# Altium schematic sheet AKS1_Sheet1.SchDoc
size A4
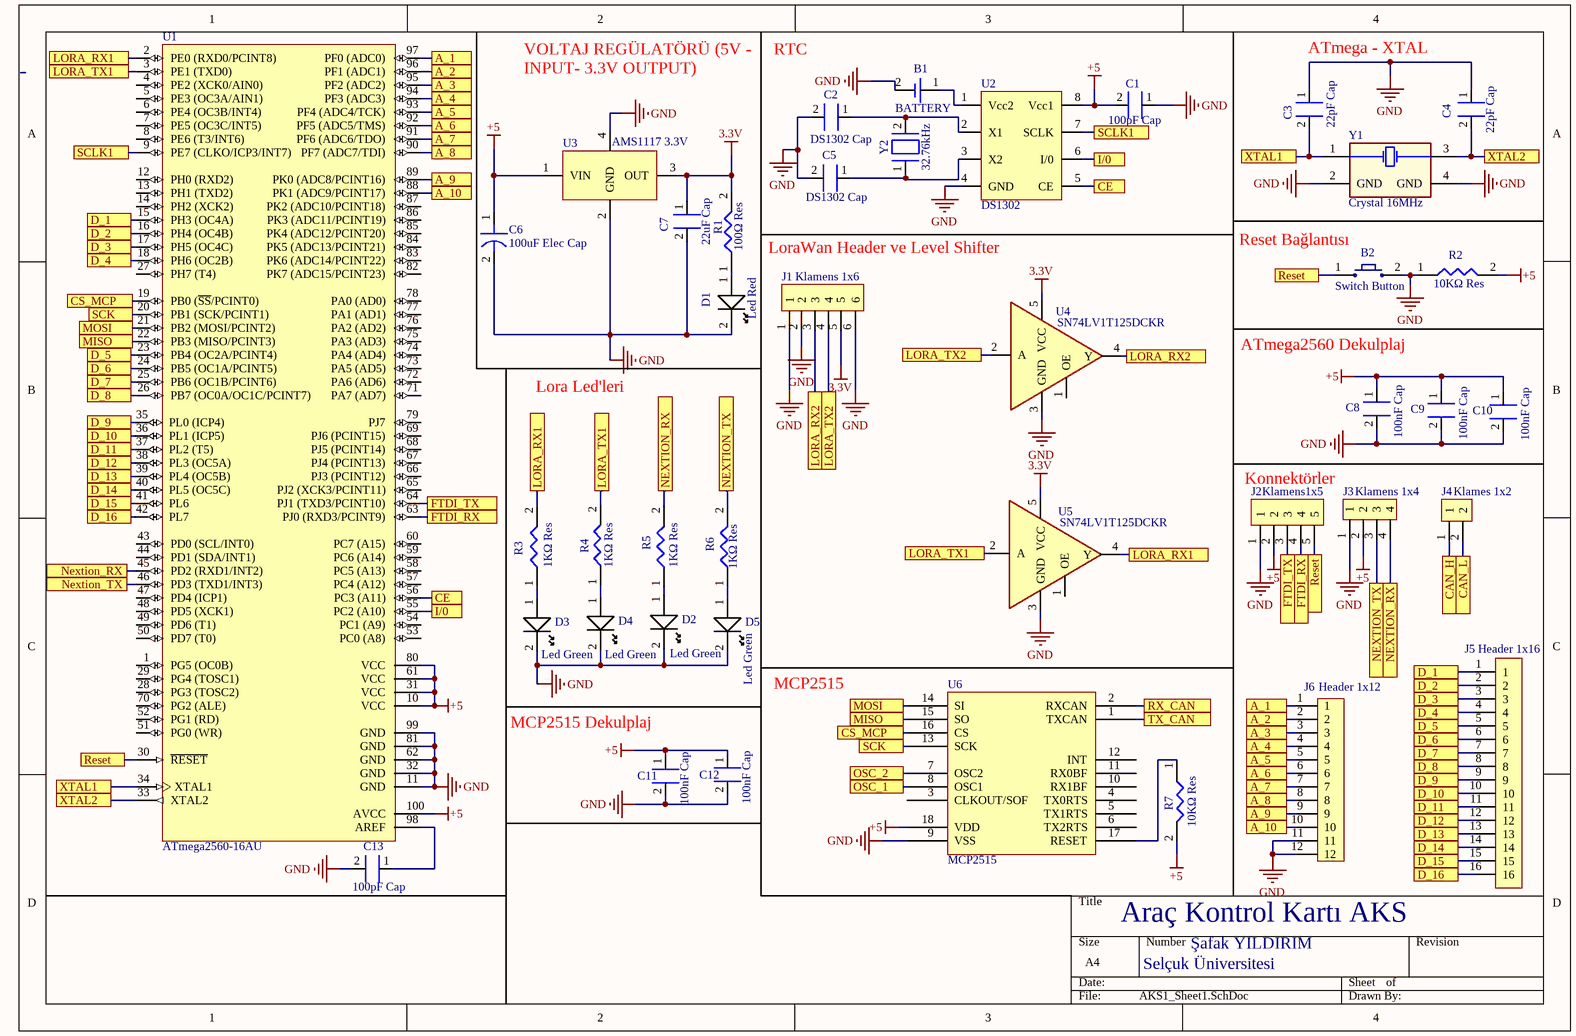
[diagram p0: AKS1_Sheet1.SchDoc]

## Parts
B1  BATTERY  [BATTERY - BH800-EEMB]
B2  Switch Button  [Switch Button]
C1  100pF Cap  [Cap 0603 - 1608]
C2  DS1302 Cap  [Cap 0603 - 1608]
C3  22pF Cap  [Cap 0603 - 1608]
C4  22pF Cap  [Cap 0603 - 1608]
C5  DS1302 Cap  [Cap 0603 - 1608]
C6  100uF Elec Cap  [100uF -  Elec Cap - CAPAE127P600-8N]
C7  22uF Cap  [Cap 0603 - 1608]
C8  100nF Cap  [Cap 0603 - 1608]
C9  100nF Cap  [Cap 0603 - 1608]
C10  100nF Cap  [Cap 0603 - 1608]
C11  100nF Cap  [Cap 0603 - 1608]
C12  100nF Cap  [Cap 0603 - 1608]
C13  100pF Cap  [Cap 0603 - 1608]
D1  Led Red  [Led 0603]
D2  Led Green  [Led 0603]
D3  Led Green  [Led 0603]
D4  Led Green  [Led 0603]
D5  Led Green  [Led 0603]
J1  Klamens 1x6  [Klamens 1x6]
J2  Klamens1x5  [Klames 1x5 3.81]
J3  Klamens 1x4  [Klames 1x4 3.81]
J4  Klames 1x2  [Klames 1x2 3.81]
J5  Header 1x16  [Header 1x16 2.54mm]
J6  Header 1x12  [Header 1x12 2.54mm]
R1  100Ω Res  [Res 0603 - 1608]
R2  10KΩ Res  [Res 0603 - 1608]
R3  1KΩ Res  [Res 0603 - 1608]
R4  1KΩ Res  [Res 0603 - 1608]
R5  1KΩ Res  [Res 0603 - 1608]
R6  1KΩ Res  [Res 0603 - 1608]
R7  10KΩ Res  [Res 0603 - 1608]
U1  ATmega2560-16AU  [ATmega 256016AU - TSQFP50P1600X1600X120-100N]
U2  DS1302  [DS1302 - SOIC127P790X213-8N]
U3  AMS1117 3.3V  [AMS1117 - SOT223127P600-8N]
U4  SN74LV1T125DCKR  [SN74LV1T125  SOT65P210X95-5N]
U5  SN74LV1T125DCKR  [SN74LV1T125  SOT65P210X95-5N]
U6  MCP2515  [MCP2515 - SOIC]
Y1  Crystal 16MHz  [16MHz OSC]
Y2  32.76kHz  [Crystal 32.7680kHz]

## Ports
A_1, A_2, A_3, A_4, A_5, A_6, A_7, A_8, A_9, A_10, CAN_H, CAN_L, CE, CS_MCP, D_1, D_2, D_3, D_4, D_5, D_6, D_7, D_8, D_9, D_10, D_11, D_12, D_13, D_14, D_15, D_16, FTDI_RX, FTDI_TX, I/0, LORA_RX1, LORA_RX2, LORA_TX1, LORA_TX2, MISO, MOSI, NEXTION_RX, Nextion_RX, NEXTION_TX, Nextion_TX, OSC_1, OSC_2, Reset, RX_CAN, SCK, SCLK1, TX_CAN, XTAL1, XTAL2

## Nets
3.3V: C7.1 J1.5 R1.2 U3.3(OUT) U4.5(VCC) U5.5(VCC)
+5: C1.2 C6.1 C8.1 C9.1 C10.1 C11.1 C12.1 J2.2 J3.2 R2.2 R7.2 U1.10(VCC) U1.31(VCC) U1.61(VCC) U1.80(VCC) U1.100(AVCC) U2.8(Vcc1) U3.1(VIN) U6.18(VDD)
GND: B1.2 B2.2 C1.1 C2.2 C3.1 C4.1 C5.2 C6.2 C7.2 C8.2 C9.2 C10.2 C11.2 C12.2 C13.2 D1.2 D2.2 D3.2 D4.2 D5.2 J1.1 J1.2 J1.6 J2.1 J3.1 J6.11 J6.12 R2.1 U1.11(GND) U1.32(GND) U1.62(GND) U1.81(GND) U1.99(GND) U2.4(GND) U3.2(GND) U3.4 U4.3(GND) U5.3(GND) U6.9(VSS) Y1.2(GND) Y1.4(GND)
A_1: J6.1 U1.97(PF0_(ADC0)) ; port A_1
A_2: J6.2 U1.96(PF1_(ADC1)) ; port A_2
A_3: J6.3 U1.95(PF2_(ADC2)) ; port A_3
A_4: J6.4 U1.94(PF3_(ADC3)) ; port A_4
A_5: J6.5 U1.93(PF4_(ADC4/TCK)) ; port A_5
A_6: J6.6 U1.92(PF5_(ADC5/TMS)) ; port A_6
A_7: J6.7 U1.91(PF6_(ADC6/TDO)) ; port A_7
A_8: J6.8 U1.90(PF7_(ADC7/TDI)) ; port A_8
A_9: J6.9 U1.89(PK0_(ADC8/PCINT16)) ; port A_9
A_10: J6.10 U1.88(PK1_(ADC9/PCINT17)) ; port A_10
CAN_H: J4.1 ; port CAN_H
CAN_L: J4.2 ; port CAN_L
CE: U1.56(PC3_(A11)) U2.5(CE) ; port CE
CS_MCP: U1.19(PB0_(~{SS}/PCINT0)) U6.16(CS) ; port CS_MCP
D_1: J5.1 U1.15(PH3_(OC4A)) ; port D_1
D_2: J5.2 U1.16(PH4_(OC4B)) ; port D_2
D_3: J5.3 U1.17(PH5_(OC4C)) ; port D_3
D_4: J5.4 U1.18(PH6_(OC2B)) ; port D_4
D_5: J5.5 U1.23(PB4_(OC2A/PCINT4)) ; port D_5
D_6: J5.6 U1.24(PB5_(OC1A/PCINT5)) ; port D_6
D_7: J5.7 U1.25(PB6_(OC1B/PCINT6)) ; port D_7
D_8: J5.8 U1.26(PB7_(OC0A/OC1C/PCINT7)) ; port D_8
D_9: J5.9 U1.35(PL0_(ICP4)) ; port D_9
D_10: J5.10 U1.36(PL1_(ICP5)) ; port D_10
D_11: J5.11 U1.37(PL2_(T5)) ; port D_11
D_12: J5.12 U1.38(PL3_(OC5A)) ; port D_12
D_13: J5.13 U1.39(PL4_(OC5B)) ; port D_13
D_14: J5.14 U1.40(PL5_(OC5C)) ; port D_14
D_15: J5.15 U1.41(PL6) ; port D_15
D_16: J5.16 U1.42(PL7) ; port D_16
FTDI_RX: J2.4 U1.63(PJ0_(RXD3/PCINT9)) ; port FTDI_RX
FTDI_TX: J2.3 U1.64(PJ1_(TXD3/PCINT10)) ; port FTDI_TX
I/0: U1.55(PC2_(A10)) U2.6(I/0) ; port I/0
LORA_RX1: R3.2 U1.2(PE0_(RXD0/PCINT8)) U5.4(Y) ; port LORA_RX1
LORA_RX2: J1.3 U4.4(Y) ; port LORA_RX2
LORA_TX1: R4.2 U1.3(PE1_(TXD0)) U5.2(A) ; port LORA_TX1
LORA_TX2: J1.4 U4.2(A) ; port LORA_TX2
MISO: U1.22(PB3_(MISO/PCINT3)) U6.15(SO) ; port MISO
MOSI: U1.21(PB2_(MOSI/PCINT2)) U6.14(SI) ; port MOSI
NEXTION_RX: J3.4 R5.2 U1.45(PD2_(RXD1/INT2)) ; port NEXTION_RX, port Nextion_RX
NEXTION_TX: J3.3 R6.2 U1.46(PD3_(TXD1/INT3)) ; port NEXTION_TX, port Nextion_TX
OSC_1: U6.8(OSC1) ; port OSC_1
OSC_2: U6.7(OSC2) ; port OSC_2
Reset: B2.1 J2.5 U1.30(~{RESET}) ; port Reset
RX_CAN: U6.2(RXCAN) ; port RX_CAN
SCK: U1.20(PB1_(SCK/PCINT1)) U6.13(SCK) ; port SCK
SCLK1: U1.9(PE7_(CLKO/ICP3/INT7)) U2.7(SCLK) ; port SCLK1
TX_CAN: U6.1(TXCAN) ; port TX_CAN
XTAL1: C3.2 U1.34(XTAL1) Y1.1 ; port XTAL1
XTAL2: C4.2 U1.33(XTAL2) Y1.3 ; port XTAL2
NetB1_1: B1.1 U2.1(Vcc2)
NetC2_1: C2.1 U2.2(X1) Y2.2
NetC5_1: C5.1 U2.3(X2) Y2.1
NetC13_1: C13.1 U1.98(AREF)
NetD1_1: D1.1 R1.1
NetD2_1: D2.1 R5.1
NetD3_1: D3.1 R3.1
NetD4_1: D4.1 R4.1
NetD5_1: D5.1 R6.1
NetR7_1: R7.1 U6.17(RESET)

Not connected (* = marked no-connect by the designer): U1 1(PG5_(OC0B)) 4(PE2_(XCK0/AIN0)) 5(PE3_(OC3A/AIN1)) 6(PE4_(OC3B/INT4)) 7(PE5_(OC3C/INT5)) 8(PE6_(T3/INT6)) 12(PH0_(RXD2)) 13(PH1_(TXD2)) 14(PH2_(XCK2)) 27(PH7_(T4)) 28(PG3_(TOSC2)) 29(PG4_(TOSC1)) 43(PD0_(SCL/INT0)) 44(PD1_(SDA/INT1)) 47(PD4_(ICP1)) 48(PD5_(XCK1)) 49(PD6_(T1)) 50(PD7_(T0)) 51(PG0_(WR)) 52(PG1_(RD)) 53(PC0_(A8)) 54(PC1_(A9)) 57(PC4_(A12)) 58(PC5_(A13)) 59(PC6_(A14)) 60(PC7_(A15)) 65(PJ2_(XCK3/PCINT11)) 66(PJ3_(PCINT12)) 67(PJ4_(PCINT13)) 68(PJ5_(PCINT14)) 69(PJ6_(PCINT15)) 70(PG2_(ALE)) 71(PA7_(AD7)) 72(PA6_(AD6)) 73(PA5_(AD5)) 74(PA4_(AD4)) 75(PA3_(AD3)) 76(PA2_(AD2)) 77(PA1_(AD1)) 78(PA0_(AD0)) 79(PJ7) 82(PK7_(ADC15/PCINT23)) 83(PK6_(ADC14/PCINT22)) 84(PK5_(ADC13/PCINT21)) 85(PK4_(ADC12/PCINT20)) 86(PK3_(ADC11/PCINT19)) 87(PK2_(ADC10/PCINT18)); U4 1(OE); U5 1(OE); U6 3(CLKOUT/SOF) 4(TX0RTS) 5(TX1RTS) 6(TX2RTS) 10(RX1BF) 11(RX0BF) 12(INT)

## Notes on the sheet
- VOLTAJ REGÜLATÖRÜ (5V - INPUT- 3.3V OUTPUT)
- RTC
- ATmega - XTAL
- (near B2) Reset Bağlantısı
- LoraWan Header ve Level Shifter
- ATmega2560 Dekulplaj
- Lora Led'leri
- Konnektörler
- MCP2515
- (near C11) MCP2515 Dekulplaj
- Araç Kontrol Kartı AKS
- Selçuk Üniversitesi
- Şafak YILDIRIM

## Library data of the parts
B1 = BH800-EEMB - BATTERY: BH800-EEMB - BATTERY HOLDER BS-3 FOR CR2032 EEMB; ComponentLink1Description: Satın Alma Linki; ComponentLink1URL: https://ozdisan.com/bataryalar/batarya-aksesuarlari/pil-yuvalari/BH800-EEMB; ComponentLink2Description: Datasheet; ComponentLink2URL: https://cdn.ozdisan.com/ETicaret_Dosya/39723_7680678.PDF
B2 = Switch Button: L-KLS7-TS3611-2.5-180-T - SWITCH TACT 3.65x6.10 2.50mm 180gF SMT V/T; ComponentLink1Description: Satın Alma Linki; ComponentLink1URL: https://www.ozdisan.com/Product/Detail/466204/L-KLS7-TS3611-2-5-180-T; ComponentLink2Description: Datasheet; ComponentLink2URL: https://cdn.ozdisan.com/ETicaret_Dosya/466204_2836822.pdf
C1 C13 = 100pF Cap: 100pF Cap 0603 - 1608; ComponentLink1Description: Satın Alma Linki; ComponentLink1URL: https://ozdisan.com/pasif-komponentler/kondansatorler/smt-smd-ve-mlcc-kondansatorler/0603N101J500NT; ComponentLink2Description: Datashhet; ComponentLink2URL: https://cdn.ozdisan.com/ETicaret_Dosya/484780_3856065.pdf
C2 C5 = DS1302 Cap: Cap 0603 - 1608; ComponentLink1Description: Satın Alma Linki; ComponentLink1URL: *; ComponentLink2Description: Datasheet; ComponentLink2URL: https://cdn.ozdisan.com/ETicaret_Dosya/29185_6597768.pdf
C3 C4 = 22pF Cap: 100pF Cap 0603 - 1608; ComponentLink1Description: Satın Alma Linki; ComponentLink1URL: https://ozdisan.com/pasif-komponentler/kondansatorler/smt-smd-ve-mlcc-kondansatorler/CL10C220JB8NNNC; ComponentLink2Description: Datashhet; ComponentLink2URL: https://cdn.ozdisan.com/ETicaret_Dosya/484780_3856065.pdf
C6 = 100uF Elec Cap: 100uF 50V SMD Elektrolitik Kondansatör 8x10mm 85C; ComponentLink1Description: Satın Alma Linki; ComponentLink1URL: https://www.direnc.net/100uf50v-7x10-smd?language=tr&h=9e593fd0; ComponentLink2Description: Datashhet; ComponentLink2URL: https://cdn.ozdisan.com/ETicaret_Dosya/420197_9090778.pdf
C7 = 22uF Cap: 22uF Cap 0603 - 1608; ComponentLink1Description: Satın Alma Linki; ComponentLink1URL: https://ozdisan.com/pasif-komponentler/kondansatorler/smt-smd-ve-mlcc-kondansatorler/CL10A226MQ8NRNC; ComponentLink2Description: Datashhets; ComponentLink2URL: https://cdn.ozdisan.com/ETicaret_Dosya/484780_3856065.pdf
C8-C10 = 100nF Cap: 100nF Cap 0603 - 1608; ComponentLink1Description: Satın Alma Linki; ComponentLink1URL: https://ozdisan.com/pasif-komponentler/kondansatorler/smt-smd-ve-mlcc-kondansatorler/CL10F104ZA8NNNC; ComponentLink2Description: Datashhet; ComponentLink2URL: https://cdn.ozdisan.com/ETicaret_Dosya/484780_3856065.pdf
C11 C12 = 100nF Cap: 100pF Cap 0603 - 1608; ComponentLink1Description: Satın Alma Linki; ComponentLink1URL: https://ozdisan.com/pasif-komponentler/kondansatorler/smt-smd-ve-mlcc-kondansatorler/CL10F104ZA8NNNC; ComponentLink2Description: Datashhet; ComponentLink2URL: https://cdn.ozdisan.com/ETicaret_Dosya/484780_3856065.pdf
D1 = Led Red: https://ozdisan.com/led-ve-aydinlatma-cozumleri/led-komponentler/sinyal-ledler-renkli/27-21R6C-AP1Q2B3C; ComponentLink1Description: Satın Alma Linki; ComponentLink1URL: https://ozdisan.com/led-ve-aydinlatma-cozumleri/led-komponentler/sinyal-ledler-renkli/27-21R6C-AP1Q2B3C; ComponentLink2Description: Datasheet; ComponentLink2URL: https://cdn.ozdisan.com/ETicaret_Dosya/602569_177145.pdf
D2-D5 = Led Green: 27-21/GHC-YR2T1/3C - LED SMD 0603 GREEN 140-360mcd 130° WATER CLEAR; ComponentLink1Description: Satın Alma Linki; ComponentLink1URL: https://ozdisan.com/led-ve-aydinlatma-cozumleri/led-komponentler/sinyal-ledler-renkli/27-21GHC-YR2T13C; ComponentLink2Description: Datasheet; ComponentLink2URL: https://cdn.ozdisan.com/ETicaret_Dosya/602568_422056.pdf
J1 = Klamens 1x6: 6 LI 3,81 MM 90° YEŞİL TAKIM KLEMENS; ComponentLink1Description: Satın Alma Linki; ComponentLink1URL: https://www.hatfon.com/urun/6-li-3-81-mm-90deg-yesil-takim-klemens; ComponentLink2Description: Datasheet; ComponentLink2URL: https://cdn.ozdisan.com/ETicaret_Dosya/404173_7658398.pdf
J2 = Klamens1x5: 5 Lİ 3,81 MM 90° YEŞİL TAKIM KLEMENS; ComponentLink1Description: Satın Alma Linki; ComponentLink1URL: https://www.hatfon.com/urun/5-li-3-81-mm-90deg-yesil-takim-klemens; ComponentLink2Description: Datasheet; ComponentLink2URL: https://cdn.ozdisan.com/ETicaret_Dosya/404173_7658398.pdf
J3 = Klamens 1x4: 4 LÜ 3,81 MM 90° YEŞİL TAKIM KLEMENS; ComponentLink1Description: Satın Alma Linki; ComponentLink1URL: https://www.hatfon.com/urun/4-lu-3-81-mm-90deg-yesil-takim-klemens; ComponentLink2Description: Datasheet; ComponentLink2URL: https://cdn.ozdisan.com/ETicaret_Dosya/404173_7658398.pdf
J4 = Klames 1x2: 2 Lİ 3,81 MM 90° YEŞİL TAKIM KLEMENS; ComponentLink1Description: Satın Alma Linki; ComponentLink1URL: https://www.hatfon.com/urun/2-li-3-81-mm-90deg-yesil-takim-klemens; ComponentLink2Description: Datasheet; ComponentLink2URL: https://cdn.ozdisan.com/ETicaret_Dosya/404173_7658398.pdf
J5 = Header 1x16: L-KLS1-207A-1-12-T - PIN HEADER 12PIN(1x12) 2.54mm SMT R/A; ComponentLink1Description: Satın Alma Linki; ComponentLink1URL: https://www.ozdisan.com/konnektor-baglanti-elemanlari/headers/pin-header/L-KLS1-207A-1-12-T; ComponentLink2Description: Datasheet; ComponentLink2URL: https://cdn.ozdisan.com/ETicaret_Dosya/475401_9310420.PDF
J6 = Header 1x12: DS1021-1X16SF11 - PIN HEADER 16PIN(1X16) 2.54mm THT V/T; ComponentLink1Description: Satın Alma Linki; ComponentLink1URL: https://www.ozdisan.com/konnektor-ve-baglanti-elemanlari/konnektor-cesitleri/pcb-konnektorler/91614-412ALF; ComponentLink2Description: Datasheet; ComponentLink2URL: https://cdn.ozdisan.com/ETicaret_Dosya/346538_5354635.pdf
R1 = 100Ω Res: 100Ω Res 0603 - 1608; ComponentLink1Description: Satın Alma Linki; ComponentLink1URL: https://www.ozdisan.com/pasif-komponentler/direncler/smt-smd-direncler/0603SAF1000T5E; ComponentLink2Description: Datasheet; ComponentLink2URL: https://cdn.ozdisan.com/ETicaret_Dosya/570122_9878629.pdf
R2 R7 = 10KΩ Res: 10KΩ Res 0603 - 1608; ComponentLink1Description: Satın Alma Linki; ComponentLink1URL: https://www.ozdisan.com/pasif-komponentler/direncler/smt-smd-ve-cip-direncler/TC0325B1002T5C; ComponentLink2Description: Datasheet; ComponentLink2URL: https://cdn.ozdisan.com/ETicaret_Dosya/570122_9878629.pdf
R3-R6 = 1KΩ Res: 1KΩ Res 0603 - 1608; ComponentLink1Description: Satın Alma Linki; ComponentLink2Description: Datasheet; ComponentLink2URL: https://cdn.ozdisan.com/ETicaret_Dosya/399380_9872459.pdf
  R3 R4 R6: ComponentLink1URL: https://www.ozdisan.com/pasif-komponentler/direncler/smt-smd-ve-cip-direncler/ERJ-3GEYJ102V
U1 = ATmega2560-16AU: ATmega2560-16AU - IC-2560 MCU 8BIT 256KB TQFP100 16MHZ ATMEL; ComponentLink1Description: Satın Alma Linki; ComponentLink1URL: https://www.ozdisan.com/entegre-devreler-ics/embedded-entegreler/mikroislemciler/ATMEGA2560-16AU; ComponentLink2Description: Datasheet; ComponentLink2URL: https://cdn.ozdisan.com/ETicaret_Dosya/409525_4637652.pdf
U2 = DS1302: DS1302 - IC-1302 TIMEKEEPER T-CHARGE 8-DIP MAXIM; ComponentLink1Description: Satın Alma Linki; ComponentLink1URL: https://ozdisan.com/entegre-devreler-ics/zamanlama-entegreleri/gercek-zamanli-saat-entegreleri/DS1307ZNTR; ComponentLink2Description: Datasheet; ComponentLink2URL: https://cdn.ozdisan.com/ETicaret_Dosya/29185_6597768.pdf
U3 = AMS1117 3.3V: AMS111733TR-HT - IC-1117 REG LDO 3.3V 1A SOT223; ComponentLink1Description: Satın Alma Linki; ComponentLink1URL: https://www.ozdisan.com/entegre-devreler-ics/guc-entegreleri/lineer-voltaj-regulatorleri/AMS111733TR-HT; ComponentLink2Description: Datasheet; ComponentLink2URL: https://cdn.ozdisan.com/ETicaret_Dosya/348307_6210366.pdf
U4 U5 = SN74LV1T125: SN74LV1T125DCKR - IC-74LV1T125 BUFFER NON-INVERT SC70-5; ComponentLink1Description: PDF; ComponentLink1URL: https://cdn.ozdisan.com/ETicaret_Dosya/591530_4256725.pdf; ComponentLink2Description: Link; ComponentLink2URL: https://www.ozdisan.com/entegre-devreler-ics/logic-entegreler/buffer-driver-receiver-ve-transceiver-entegreleri/SN74LV1T125DCKR
U6 = MCP2515: MCP2515 SOIC-18 SMD CAN Bus Entegresi; ComponentLink1Description: Satın Alma Linki; ComponentLink1URL: https://www.direnc.net/mcp2515-smd-can-interface-ic-w-spi-interface; ComponentLink2Description: Datasheet; ComponentLink2URL: https://pdf.direnc.net/upload/mcp2515-datasheet.pdf
Y1 = Crystal 16MHz: ASX5F-16M-FE180C3 - CRYSTAL 16MHZ 18pF 5.0X3.2 SMD XTAL TR; ComponentLink1Description: Satın Alma Linki; ComponentLink1URL: https://www.ozdisan.com/pasif-komponentler/kristaller-osilatorler-ve-rezanatorler/kristaller/ASX5F-16M-FE180C3; ComponentLink2Description: Datasheet; ComponentLink2URL: https://cdn.ozdisan.com/ETicaret_Dosya/428915_5305162.pdf
Y2 = Crystal  32.76kHz: RT2012-32.768-12.5-20-EX - CRYSTAL 32.7680kHz 12.5pF 20ppm; ComponentLink1Description: Satın Alma Linki; ComponentLink1URL: https://ozdisan.com/pasif-komponentler/kristaller-osilatorler-ve-rezanatorler/kristaller/RT2012-32-768-12-5-20-EX; ComponentLink2Description: Datasheet; ComponentLink2URL: https://cdn.ozdisan.com/ETicaret_Dosya/458859_8577242.PDF